# EAGLE design door_board (EAGLE 9.2.2)
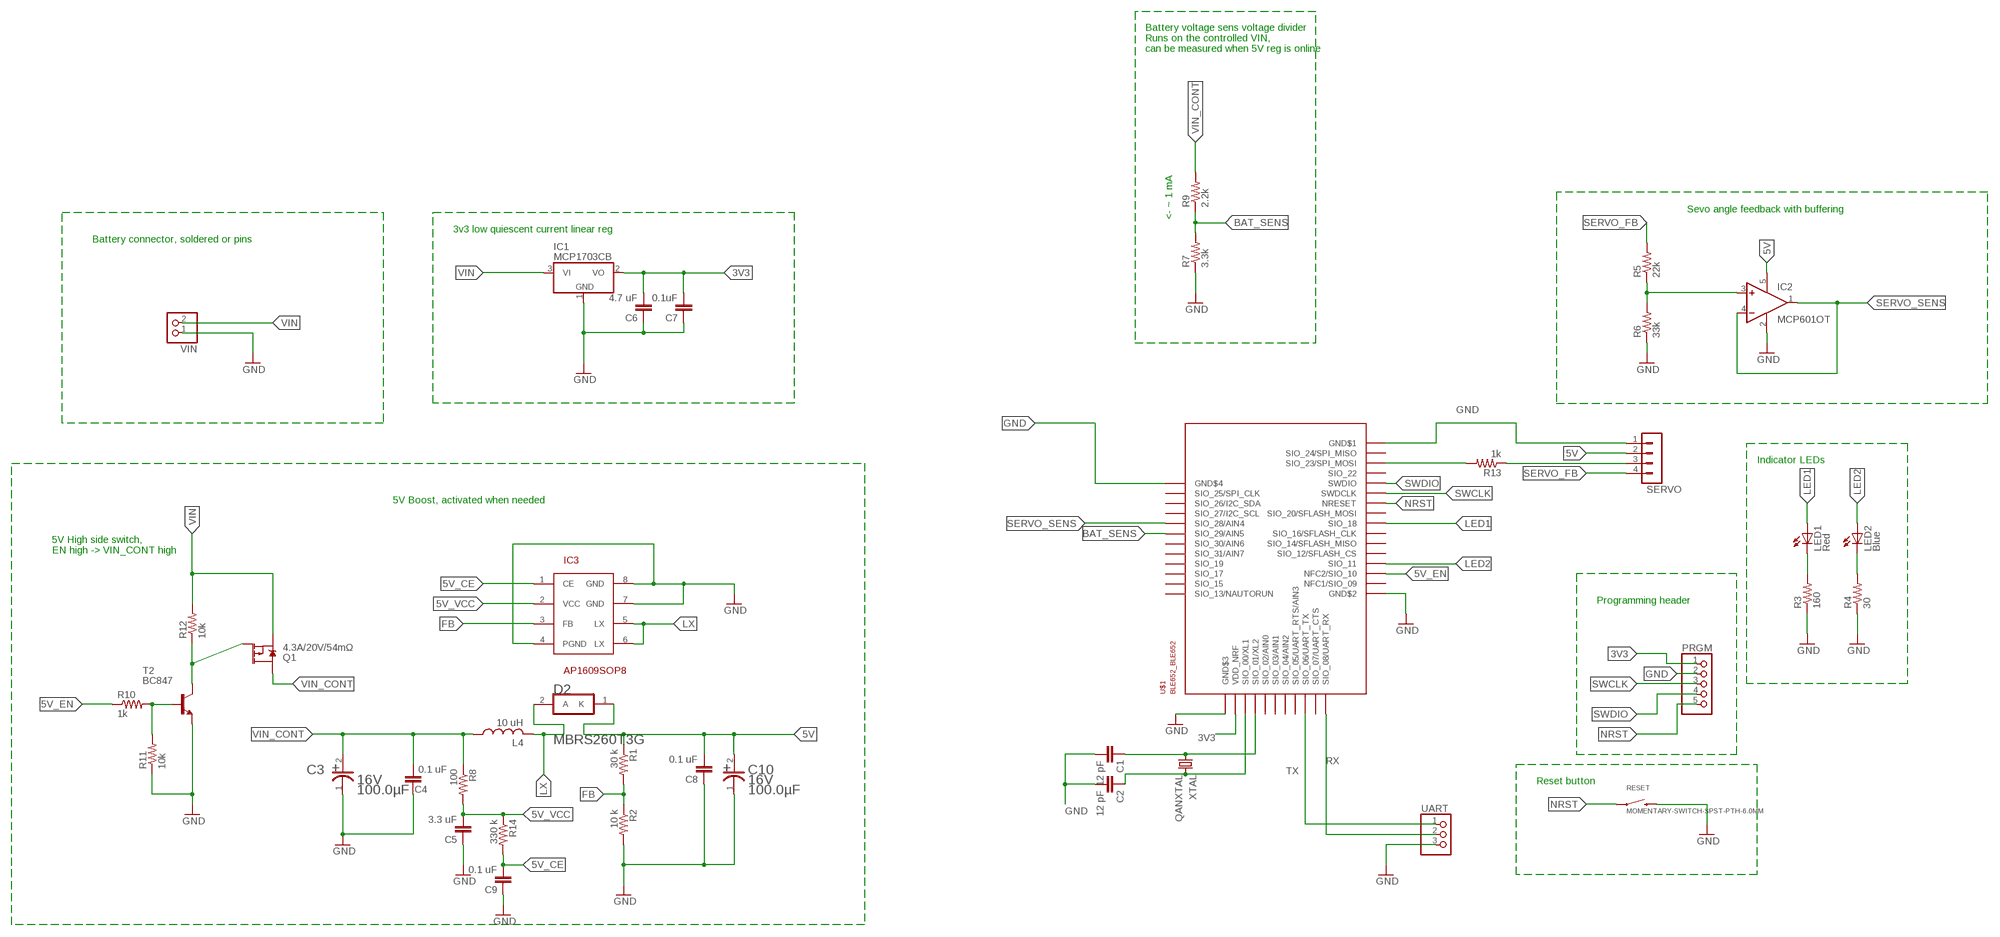
[diagram p0: schematic, sheet 1]

## Parts
C1  12 pF  C-EUC0603  [C0603]
C2  12 pF  C-EUC0603  [C0603]
C3  PANASONIC_EEE-FK1C101PPANASONIC_EEE-FK1C101P_0_0  [PANASONIC_EEE-FK1C101P_0]
C4  0.1 uF  C-EUC0805  [C0805]
C5  3.3 uF  C-EUC0805  [C0805]
C6  4.7 uF  C-EUC0805  [C0805]
C7  0.1uF  C-EUC0805  [C0805]
C8  0.1 uF  C-EUC0805  [C0805]
C9  0.1 uF  C-EUC0805  [C0805]
C10  PANASONIC_EEE-FK1C101PPANASONIC_EEE-FK1C101P_0_0  [PANASONIC_EEE-FK1C101P_0]
D2  ON_SEMICONDUCTOR_MBRS260T3GON_SEMICONDUCTOR_MBRS260T3G_0_0  [ON_SEMICONDUCTOR_MBRS260T3G_0]
IC1  MCP1703CB  [SOT23]
IC2  MCP601OT  [SOT23-5]
IC3  AP1609SOP8  [SOIC127P600X175-8]
L4  10 uH  FDSD0420  [SMT]
LED1  Red  LEDCHIP-LED0805  [CHIP-LED0805]
LED2  Blue  LEDCHIP-LED0805  [CHIP-LED0805]
PRGM  PINHD-1X5  [1X05]
Q1  4.3A/20V/54mΩ  MOSFET_PCH-IRLML2244  [SOT23-3]
R1  30 k  R-US_M0805  [M0805]
R2  10 k  R-US_M0805  [M0805]
R3  160  R-US_M0805  [M0805]
R4  30  R-US_M0805  [M0805]
R5  22k  R-US_M0805  [M0805]
R6  33k  R-US_M0805  [M0805]
R7  3.3k  R-US_M0805  [M0805]
R8  100  R-US_M0805  [M0805]
R9  2.2k  R-US_M0805  [M0805]
R10  1k  R-US_M0805  [M0805]
R11  10k  R-US_M0805  [M0805]
R12  10k  R-US_M0805  [M0805]
R13  1k  R-US_M0805  [M0805]
R14  330 k  R-US_M0805  [M0805]
RESET  MOMENTARY-SWITCH-SPST-PTH-6.0MM  [TACTILE_SWITCH_PTH_6.0MM]
SERVO  MA04-1  [MA04-1]
T2  BC847  [SOT23]
U$1  BLE652_BLE652  [BLE652_BL652]
UART  PINHD-1X3  [1X03]
VIN  PINHD-1X2  [1X02]
XTAL  QANXTAL  [QANTEKXTAL]

## Nets
3V3: C6.2 C7.2 IC1.2(VO) PRGM.1 U$1.P$26(VDD_NRF)
5V: C8.2 C10.2(ANODE) D2.1(K) IC2.5(V+) R1.1 SERVO.2
5V_CE: C9.2 IC3.1(CE) R14.2
5V_EN: R10.1 U$1.P$14(NFC2/SIO_10)
5V_VCC: C5.2 IC3.2(VCC) R8.2 R14.1
ADFSGSDFH: IC2.3(+IN) R5.1 R6.2
BAT_SENS: R7.2 R9.1 U$1.P$34(SIO_29/AIN5)
FB: IC3.3(FB) R1.2 R2.1
GND: C1.2 C2.2 C3.1(CATHODE) C4.1 C5.1 C6.1 C7.1 C8.1 C9.1 C10.1(CATHODE) IC1.1(GND) IC2.2(V-) IC3.4(PGND) IC3.7(GND) IC3.8(GND) PRGM.2 R2.2 R3.1 R4.1 R6.1 R7.1 R11.1 RESET.3 SERVO.1 T2.2(E) U$1.P$1(GND$1) U$1.P$16(GND$2) U$1.P$27(GND$3) U$1.P$39(GND$4) UART.3 VIN.1
LED1: LED1.A U$1.P$9(SIO_18)
LED2: LED2.A U$1.P$13(SIO_11)
LX: D2.2(A) IC3.5(LX) IC3.6(LX) L4.P2
N$1: C1.1 U$1.P$24(SIO_01/XL2) XTAL.1
N$2: C2.1 U$1.P$25(SIO_00/XL1) XTAL.2
N$6: R13.1 SERVO.3
N$9: LED2.C R4.2
N$10: LED1.C R3.2
N$17: R10.2 R11.2 T2.1(B)
N$18: Q1.1(G) R12.1 T2.3(C)
N$20: R13.2 U$1.P$3(SIO_23/SPI_MOSI)
NRST: PRGM.5 RESET.1 U$1.P$7(NRESET)
RX: U$1.P$17(SIO_08/UART_RX) UART.2
SERVO_FB: R5.2 SERVO.4
SERVO_SENS: IC2.1(OUT) IC2.4(-IN) U$1.P$35(SIO_28/AIN4)
SWCLK: PRGM.3 U$1.P$6(SWDCLK)
SWDIO: PRGM.4 U$1.P$5(SWDIO)
TX: U$1.P$19(SIO_06/UART_TX) UART.1
VIN: IC1.3(VI) Q1.2(S) R12.2 VIN.2
VIN_CONT: C3.2(ANODE) C4.2 L4.P1 Q1.3(D) R8.1 R9.2
Unconnected: U$1.P$2(SIO_24/SPI_MISO) U$1.P$4(SIO_22) U$1.P$8(SIO_20/SFLASH_MOSI) U$1.P$10(SIO_16/SFLASH_CLK) U$1.P$11(SIO_14/SFLASH_MISO) U$1.P$12(SIO_12/SFLASH_CS) U$1.P$15(NFC1/SIO_09) U$1.P$18(SIO_07/UART_CTS) U$1.P$20(SIO_05/UART_RTS/AIN3) U$1.P$21(SIO_04/AIN2) U$1.P$22(SIO_03/AIN1) U$1.P$23(SIO_02/AIN0) U$1.P$28(SIO_13/NAUTORUN) U$1.P$29(SIO_15) U$1.P$30(SIO_17) U$1.P$31(SIO_19) U$1.P$32(SIO_31/AIN7) U$1.P$33(SIO_30/AIN6) U$1.P$36(SIO_27/I2C_SCL) U$1.P$37(SIO_26/I2C_SDA) U$1.P$38(SIO_25/SPI_CLK)

## Notes on the sheet
- Battery voltage sens voltage divider
  Runs on the controlled VIN, 
  can be measured when 5V reg is online
- <- ~ 1 mA
- Sevo angle feedback with buffering
- 3v3 low quiescent current linear reg
- Battery connector, soldered or pins
- Indicator LEDs
- 5V Boost, activated when needed
- 5V High side switch,
  EN high -> VIN_CONT high
- Programming header
- Reset button

## Library data of the parts
C1 C2 C4-C9 = rcl:C-EU: CAPACITOR, European symbol; SPICEPREFIX: C
C3 C10 = Panasonic - EEE-FK1C101P:PANASONIC_EEE-FK1C101P: Cap Aluminum Lytic 100uF 16V 20% (6.3 X 5.8mm) SMD 240mA 2000h 105C Automotive T/R; CAPACITANCE: 100.0µF; CENTROID_NOT_SPECIFIED: No; DATASHEET: https://industrial.panasonic.com/cdbs/www-data/pdf/RDE0000/ABA0000C1181.pdf; DIGIKEY_DESCRIPTION: CAP ALUM 100UF 20% 16V SMD; DIGIKEY_PART_NUMBER: PCE3783CT-ND; LEAD_FREE: yes; MF: Panasonic; MFG_PACKAGE_IDENT: EEEFK; MOUSER_DESCRIPTION: Aluminum Electrolytic Capacitors - SMD 100uF 16V; MOUSER_PART_NUMBER: 667-EEE-FK1C101P; MPN: EEE-FK1C101P; PACKAGE: RADIAL; PREFIX: C; ROHS: yes; TEMPERATURE_RANGE_HIGH: +105°C; TEMPERATURE_RANGE_LOW: -55°C; VOLTAGE: 16V
D2 = On Semiconductor - MBRS260T3G:ON_SEMICONDUCTOR_MBRS260T3G: ONSC-D-K1A2-2_A; CIIVA_IDS: 816703; COMPONENT_LINK_1_DESCRIPTION: Manufacturer URL; COMPONENT_LINK_1_URL: http://www.onsemi.com/; COMPONENT_LINK_3_DESCRIPTION: Package Specification; COMPONENT_LINK_3_URL: http://www.onsemi.com/pub_link/Collateral/403A-03.PDF; CONFIGURATION: Single; DATASHEET: http://www.onsemi.com/pub_link/Collateral/MBRS260T3-D.PDF; DATASHEET_VERSION: Rev. 7; FOOTPRINT_VARIANT_NAME_0: Manufacturer Recommended; IFSM_MAX_A: 60; IMPORTED: yes; IMPORTED_FROM: vault; IMPORT_TS: 1521863410; MF: On Semiconductor; MOUNTING_TECHNOLOGY: Surface Mount; MPN: MBRS260T3G; PACKAGE: SMB-2-403A-03; PACKAGE_DESCRIPTION: 2-Pin Small Molded Package, J-Bend Lead, Body 4.33 x 3.625 mm; PACKAGE_VERSION: Rev. J, 07/2012; PACKING: Tape and Reel; PREFIX: D; RELEASE_DATE: 1407123037; ROHS: Yes; VAULT_GUID: 0415DD07-B68C-4AAD-A0F5-28F72E58D1C2; VAULT_REVISION: C386476E-57C5-435E-9BA6-C49E34E234E7
IC1 = linear:MCP1703: 250 mA, 16V, Low Quiescent Current LDO Regulator Source: http://ww1.microchip.com/downloads/en/DeviceDoc/22049b.pdf
IC2 = linear:MCP601: Single Op Amp 2.7V to 6.0V Single Supply CMOS Source: http://ww1.microchip.com/downloads/en/DeviceDoc/21314g.pdf
IC3 = AP1609:AP1609
L4 = FDSD0420:FDSD0420
LED1 LED2 = adafruit:LED: LED OSRAM: - CHIPLED LG R971, LG N971, LY N971, LG Q971, LY Q971, LO R971, LY R971 LH N974, LH R974 LS Q976, LO Q976, LY Q976 LO Q996 - Hyper CHIPLED LW Q18S LB Q993, LB Q99A, LB R99A - SideLED LS A670, LO A670, LY A670, LG A670, LP A670 LB A673, LV A673, LT A673, LW A673 LH A674 LY A675 LS A676, LA A676, LO A676, LY A676, LW A676 LS A679, LY A679, LG A679 - Hyper Micro SIDELED® LS Y876, LA Y876, LO Y876, LY Y876 LT Y87S - SmartLED LW L88C, LW L88S LB L89C, LB L89S, LG L890 LS L89K, LO L89K, LY L89K LS L896, LA L896, LO L896, LY L896 - TOPLED LS T670, LO T670, LY T670, LG T670, LP T670 LSG T670, LSP T670, LSY T670, LOP T670, LYG T670 LG T671, LOG T671, LSG T671 LB T673, LV T673, LT T673, LW T673 LH T674 LS T676, LA T676, LO T676, LY T676, LB T676, LH T676, LSB T676, LW T676 LB T67C, LV T67C, LT T67C, LS T67K, LO T67K, LY T67K, LW E67C LS E67B, LA E67B, LO E67B, LY E67B, LB E67C, LV E67C, LT E67C LW T67C LS T679, LY T679, LG T679 LS T770, LO T770, LY T770, LG T770, LP T770 LB T773, LV T773, LT T773, LW T773 LH T774 LS E675, LA E675, LY E675, LS T675 LS T776, LA T776, LO T776, LY T776, LB T776 LHGB T686 LT T68C, LB T68C - Hyper Mini TOPLED® LB M676 - Mini TOPLED Santana® LG M470 LS M47K, LO M47K, LY M47K Source: http://www.osram.convergy.de/
PRGM = pinhead:PINHD-1X5: PIN HEADER
Q1 = SparkFun-DiscreteSemi:MOSFET_PCH: P-channel MOSFETs Voltage controlled devices that allow control of high current outputs. SparkFun Products: SparkFun ESP32 Thing <https://www.sparkfun.com/products/13907> SparkFun ESP8266 Thing <https://www.sparkfun.com/products/13231>; PROD_ID: TRANS-11153
R1-R14 = adafruit:R-US_: RESISTOR, American symbol
RESET = SparkFun-Switches:MOMENTARY-SWITCH-SPST: Momentary Switch (Pushbutton) - SPST Normally-open (NO) SPST momentary switches (buttons, pushbuttons). Variants PTH-12MM - 12mm square, through-hole Momentary Pushbutton Switch - 12mm Square <https://www.sparkfun.com/products/9190> (COM-09190) PTH-6.0MM, PTH-6.0MM-KIT - 6.0mm square, through-hole Mini Pushbutton Switch <https://www.sparkfun.com/products/97> (COM-00097) KIT package intended for soldering kit's - only one side of pads' copper is exposed. PTH-RIGHT-ANGLE-KIT - Right-angle, through-hole Right Angle Tactile Button <https://www.sparkfun.com/products/10791> - Used on SparkFun BigTime Watch Kit <https://www.sparkfun.com/products/11734> SMD-12MM - 12mm square, surface-mount Tactile Button - SMD (12mm) <https://www.sparkfun.com/products/12993> (COM-12993) Used on SparkFun PicoBoard <https://www.sparkfun.com/products/11888> SMD-4.5MM - 4.5mm Square Trackball Switch Used on SparkFun Blackberry Trackballer Breakout <https://www.sparkfun.com/products/13169> SMD-4.6MMX2.8MM - 4.60mm x 2.80mm, surface mount Used on SparkFun SAMD21 Mini Breakout <https://www.sparkfun.com/products/13664> SMD-5.2MM, SMD-5.2-REDUNDANT - 5.2mm square, surface-mount Mini Pushbutton Switch - SMD <https://www.sparkfun.com/products/8720> (COM-08720) Used on Arduino Pro Mini <https://www.sparkfun.com/products/11114> REDUNDANT package connects both switch circuits together SMD-6.0X3.5MM - 6.0 x 3.5mm, surface mount Momentary Reset Switch SMD <https://www.sparkfun.com/products/8229> (COM-08229) SMD-6.2MM-TALL - 6.2mm square, surface mount Tactile Button - SMD (6mm) <https://www.sparkfun.com/products/12992> Used on SparkFun Digital Sandbox <https://www.sparkfun.com/products/12651> SMD-RIGHT-ANGLE - Right-angle, surface mount Used on SparkFun Block for Intel® Edison - Arduino <https://www.sparkfun.com/products/13036>; PROD_ID: SWCH-08441; SF_SKU: COM-00097
SERVO = con-lstb:MA04-1: PIN HEADER; OC_FARNELL: unknown; OC_NEWARK: unknown
T2 = transistor:BC847: NPN TRANSISTOR
U$1 = prototype1:BLE652_BLE652
UART = pinhead:PINHD-1X3: PIN HEADER
VIN = pinhead:PINHD-1X2: PIN HEADER
XTAL = BLE:QANXTAL

## Board
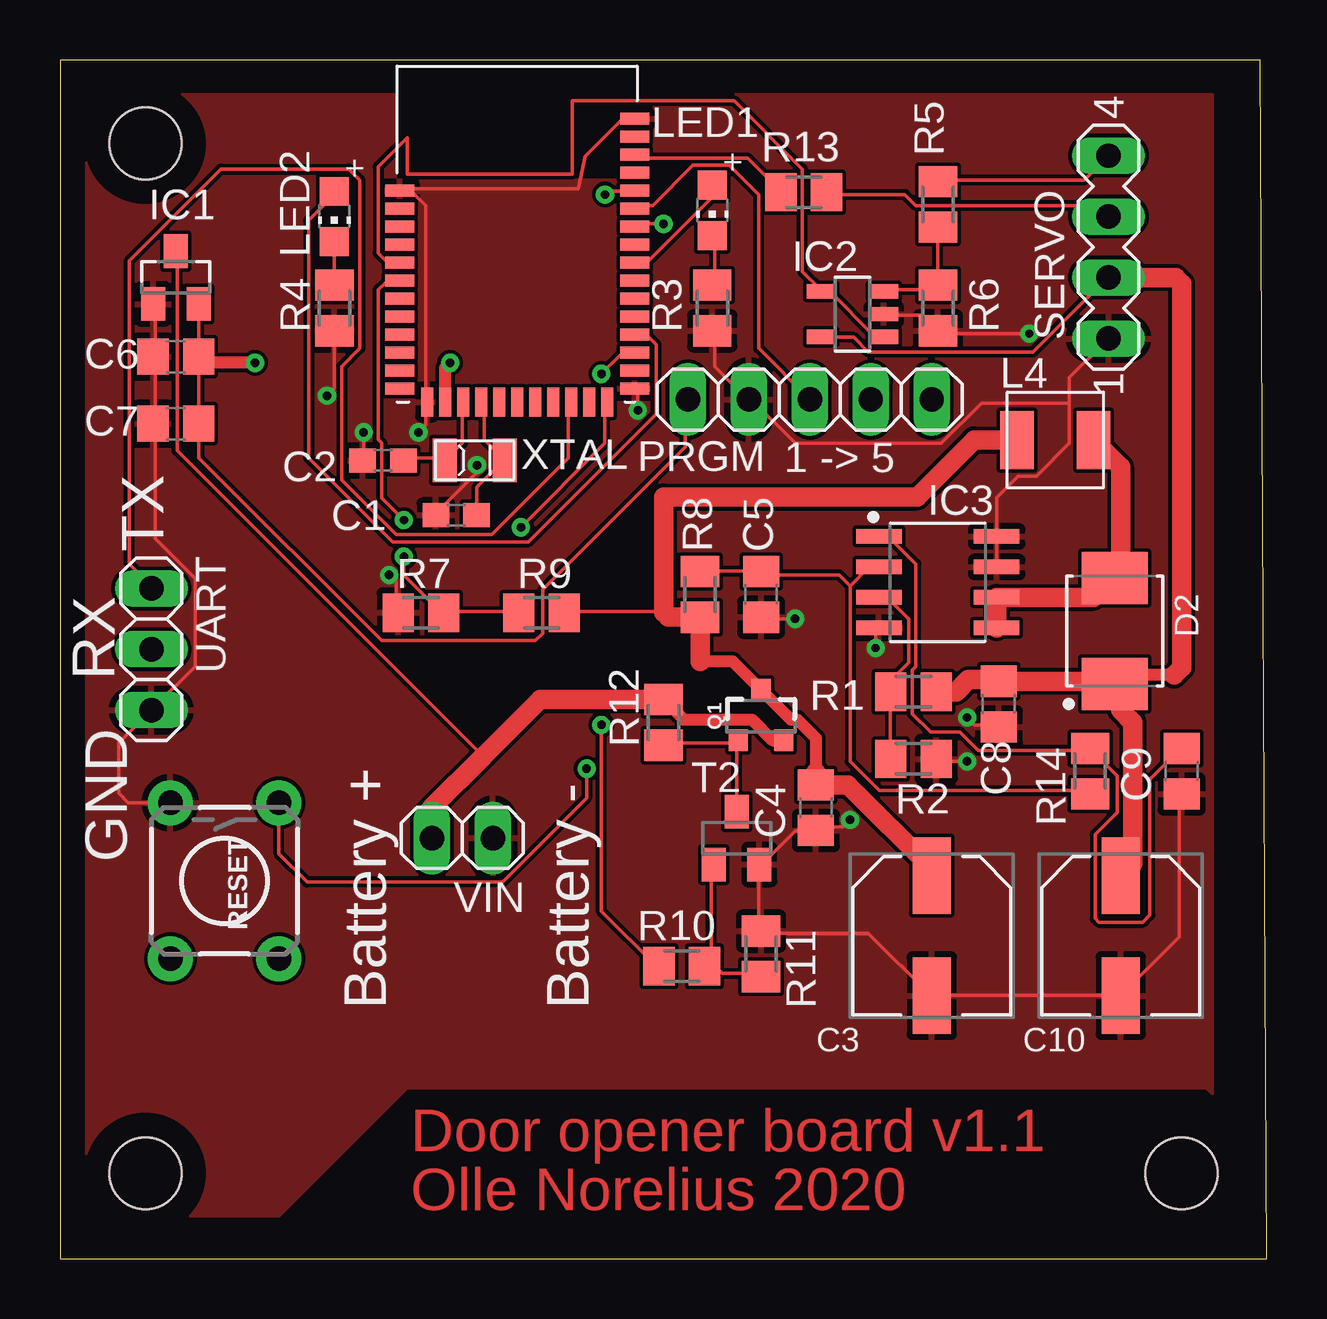
[diagram p1: board, top side]
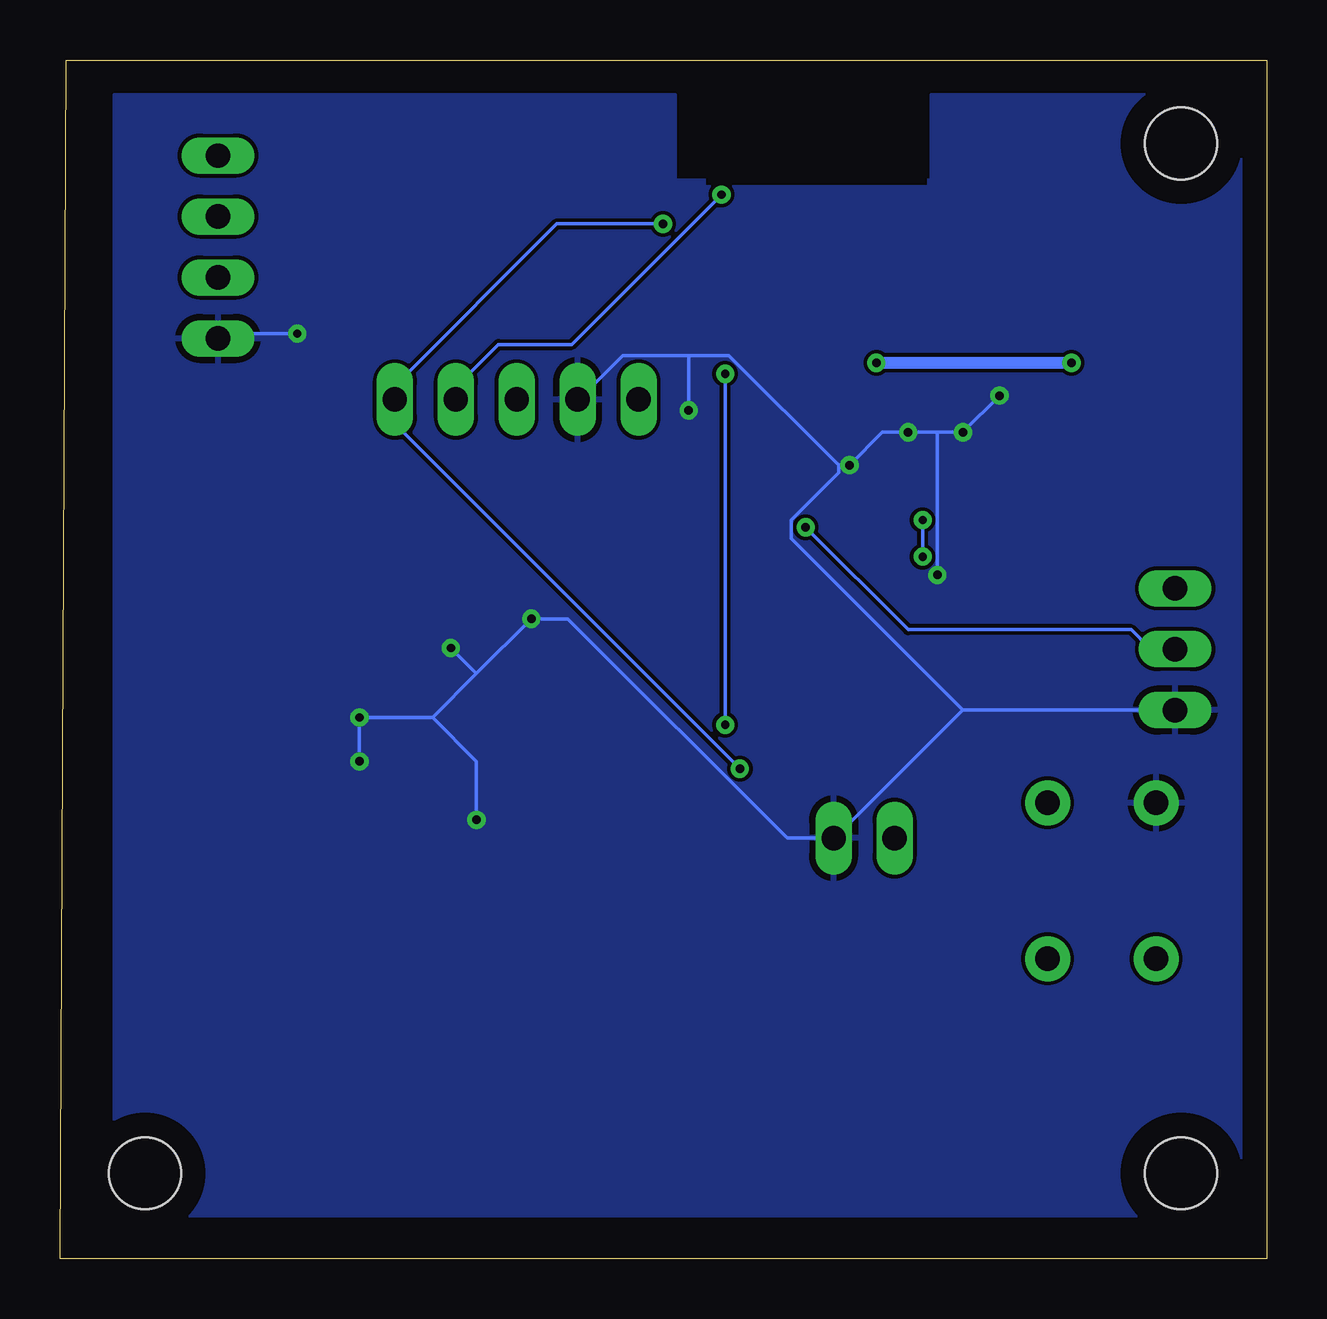
[diagram p2: board, bottom side, seen from below]

Size 50.27 x 49.96 mm. Coordinates in mm from the lower left corner, seen from the top.
Outline: 0,0 50.27,0 50.02,49.96 0,49.96 0,0
Copper layers (1*16): Top 0.035mm / dielectric 1.5mm / Bottom 0.035mm
Design rules "default": minimum track width 6mil, minimum drill 0.35mm, track to track 6mil, track to pad 6mil, pad to pad 6mil, via to via 6mil, smd to smd 6mil, copper to edge 40mil, drill to drill 6mil, minimum pad ring 10mil, minimum via ring 8mil, stop-mask expansion 4mil, vias tented up to drill 0mil, thermal gap 10mil
Holes 3 mm at 3.56,3.56 3.56,46.48 46.74,3.56
tKeepout: area 14.2,45.3 to 24.4,50; area 18.7,43.3 to 21.4,45.3

### Footprints (pad centres in the part's own frame; a part is rotated, then mirrored left to right if it is on the bottom)
C0603 = smd 1.1 x 1: 1 -0.85,0; 2 0.85,0
PANASONIC_EEE-FK1C101P_0 = smd 3.2 x 1.6: 1 -2.5,0; 2 2.5,0
C0805 = smd 1.3 x 1.5: 1 -0.95,0; 2 0.95,0
ON_SEMICONDUCTOR_MBRS260T3G_0 = smd 2.159 x 2.743: 1 -2.21,0; 2 2.21,0
SOT23 = smd 1 x 1.4: 1 -0.95,-1.1; 2 0.95,-1.1; 3 0,1.1
SOT23-5 = smd 0.6 x 1.2: 1 -0.95,-1.306; 2 0,-1.306; 3 0.95,-1.306; 4 0.95,1.306; 5 -0.95,1.306
SOIC127P600X175-8 = smd 1.896 x 0.602: 1 -2.452,1.905; 2 -2.452,0.635; 3 -2.452,-0.635; 4 -2.452,-1.905; 5 2.452,-1.905; 6 2.452,-0.635; 7 2.452,0.635; 8 2.452,1.905
SMT = smd 1.4 x 2.4: P1 -1.6,0; P2 1.6,0
CHIP-LED0805 = smd 1.2 x 1.2: A 0,-1.05; C 0,1.05
1X05 = drill 1.016 long: 1 -5.08,0; 2 -2.54,0; 3 0,0; 4 2.54,0; 5 5.08,0
SOT23-3 = smd 0.8 x 0.9: 1 -0.95,-1; 2 0.95,-1; 3 0,1.1
M0805 = smd 1.3 x 1.6: 1 -0.95,0; 2 0.95,0
TACTILE_SWITCH_PTH_6.0MM = drill 1.016 pad 1.88: 1 -3.251,2.261; 2 3.251,2.261; 3 -3.251,-2.261; 4 3.251,-2.261
MA04-1 = drill 1.016 long: 1 -3.81,0; 2 -1.27,0; 3 1.27,0; 4 3.81,0
BLE652_BL652 = smd 0.5 x 1.2: P$1 2.8,-4.9; P$2 2.05,-4.9; P$3 1.3,-4.9; P$4 0.55,-4.9; P$5 -0.2,-4.9; P$6 -0.95,-4.9; P$7 -1.7,-4.9; P$8 -2.45,-4.9; P$9 -3.2,-4.9; P$10 -3.95,-4.9; P$11 -4.7,-4.9; P$12 -5.45,-4.9; P$13 -6.2,-4.9; P$14 -6.95,-4.9; P$15 -7.7,-4.9; P$16 -8.45,-4.9; P$28 -8.45,4.9; P$29 -7.7,4.9; P$30 -6.95,4.9; P$31 -6.2,4.9; P$32 -5.45,4.9; P$33 -4.7,4.9; P$34 -3.95,4.9; P$35 -3.2,4.9; P$36 -2.45,4.9; P$37 -1.7,4.9; P$38 -0.95,4.9; P$39 -0.2,4.9 | smd 1.2 x 0.5: P$17 -9,-3.75; P$18 -9,-3; P$19 -9,-2.25; P$20 -9,-1.5; P$21 -9,-0.75; P$22 -9,0; P$23 -9,0.75; P$24 -9,1.5; P$25 -9,2.25; P$26 -9,3; P$27 -9,3.75
1X03 = drill 1.016 long: 1 -2.54,0; 2 0,0; 3 2.54,0
1X02 = drill 1.016 long: 1 -1.27,0; 2 1.27,0
QANTEKXTAL = smd 1 x 1.8: 1 -1,0; 2 1.5,0

### Placement (x,y rotation side)
C1  16.51,30.99 180 top
C2  13.46,33.27 180 top
C3  36.32,13.46 90 top
C4  31.5,18.8 90 top
C5  29.21,27.69 90 top
C6  4.83,37.59 0 top
C7  4.83,34.8 0 top
C8  39.12,23.11 90 top
C9  46.74,20.32 90 top
C10  44.2,13.46 90 top
D2  43.94,26.16 90 top
IC1  4.83,40.89 0 top
IC2  33.02,39.37 90 top
IC3  36.58,28.19 0 top
L4  41.47,34.12 0 top
LED1  27.18,43.69 180 top
LED2  11.43,43.43 180 top
PRGM  31.24,35.81 0 top
Q1  29.21,22.61 0 top
R1  35.56,23.62 180 top
R2  35.56,20.83 0 top
R3  27.18,39.62 90 top
R4  11.43,39.62 90 top
R5  36.58,43.94 90 top
R6  36.58,39.62 90 top
R7  15.04,26.92 0 top
R8  26.67,27.69 90 top
R9  20.07,26.92 0 top
R10  25.91,12.19 0 top
R11  29.21,12.7 270 top
R12  25.15,22.35 90 top
R13  30.99,44.45 180 top
R14  42.93,20.32 90 top
RESET  6.86,15.75 270 top
SERVO  43.69,42.16 90 top
T2  28.19,17.53 0 top
U$1  19.05,44.7 90 top
UART  3.81,25.4 270 top
VIN  16.76,17.53 180 top
XTAL  17.53,33.27 180 top

### Tracks (layer width: path | path; a pad name or v marks a point on that pad's centre or on a via)
3V3  (via drill 0.35)
  Top 0.152: IC1.2 5.79,39.78 5.79,37.64 C6.2 5.79,37.49 5.79,37.34 5.79,34.9 C7.2 5.79,34.75 5.79,33.38 13.41,25.76 19.81,25.76 20.12,26.06 20.12,27.89 26.06,33.83 26.06,35.81 PRGM.1
  Top 0.508: U$1.P$26 16.05,37.13 v16.26,37.34 | v8.13,37.34 5.79,37.34
  Bottom 0.508: v16.26,37.34 v8.13,37.34
5V
  Top 0.152: IC2.5 31.85,38.41 33.07,38.41 33.68,37.8 40.54,37.8 43.43,40.69 SERVO.2 | 44.2,22.86 44.2,23.7 D2.1 43.94,24.06
  Top 0.508: 46.42,24.32 44.2,24.32 43.94,24.06
  Top 0.813: 44.2,22.86 44.7,22.35 44.7,16.47 C10.2 | 43.94,24.06 C8.2 39.05,24.13 37.85,24.13 37.34,23.62 R1.1 | 46.42,24.32 46.74,24.64 46.74,40.64 46.48,40.89 SERVO.2
5V_CE
  Top 0.152: C9.2 46.63,21.18 45.41,19.96 45.41,14.33 45.11,14.02 43.28,14.02 43.13,14.17 43.13,17.68 44.04,18.59 44.04,20.12 42.98,21.18 R14.2 42.82,21.18 38.25,21.18 37.49,21.95 36.27,21.95 35.51,22.71 35.51,24.54 35.66,24.69 35.66,28.96 34.59,30.02 34.14,30.02 IC3.1
5V_EN  (via drill 0.35)
  Top 0.152: v22.55,36.88 23.32,37.64 23.93,37.64 U$1.P$14 | v22.55,22.25 22.55,14.48 24.84,12.19 R10.1
  Bottom 0.152: v22.55,22.25 v22.55,36.88
5V_VCC
  Top 0.152: R8.2 29.11,28.65 C5.2 29.26,28.5 32.46,28.5 32.92,28.04 | 32.92,28.04 32.92,20.73 34.14,19.51 42.82,19.51 R14.1 | 32.92,28.04 33.68,28.8 33.98,28.8 IC3.2
ADFSGSDFH
  Top 0.152: IC2.3 34.44,40.39 36.42,40.39 36.58,40.54 R6.2 R5.1
BAT_SENS  (via drill 0.35)
  Top 0.152: v14.33,30.79 13.41,31.7 13.41,33.98 13.26,34.14 13.26,40.39 13.56,40.69 14.02,40.69 U$1.P$34 | v14.33,29.26 14.33,28.5 15.85,26.98 R7.2 16,26.98 19.05,26.98 R9.1
  Bottom 0.152: v14.33,29.26 v14.33,30.79
FB
  Top 0.152: R2.1 34.59,20.88 34.59,23.62 R1.2 34.75,23.62 34.75,24.23 35.36,24.84 35.36,26.67 34.59,27.43 34.14,27.43 IC3.3
GND  (via drill 0.35)
  Top 0.152: 14.53,44.6 14.28,44.6 14.33,44.55 14.28,44.5 U$1.P$39 | 14.53,44.6 21.6,44.6 21.89,45.95 23.44,47.5 U$1.P$1 | 15.24,35.81 15.3,35.81 | IC2.2 34.44,39.32 35.97,39.32 36.58,38.71 R6.1 36.58,38.56 v40.39,38.56 | 42.06,35.66 42.06,36.73 SERVO.1 | 42.06,35.66 42.06,33.98 40.69,32.61 39.93,32.61 39.03,31.71 IC3.8 IC3.7 | 15.24,35.81 15.24,43.89 14.53,44.6 | 15.24,35.81 U$1.P$27 15.24,35.66 15.24,34.75 v14.94,34.44 | v17.37,33.07 17.37,32.77 15.7,31.09 C1.2 | v12.65,34.44 12.65,33.38 C2.2 | v24.08,35.36 24.08,36.12 U$1.P$16 | v13.72,28.5 14.02,28.19 14.02,26.98 R7.1 | R4.1 11.43,36.27 v11.12,35.97 | R3.1 27.28,38.56 27.28,37.19 28.65,35.81 PRGM.2 28.8,35.81 30.63,33.98 36.73,33.98 38.41,35.66 42.06,35.66 | 44.2,10.97 46.63,13.41 46.63,19.36 C9.1 | 44.2,10.97 36.42,10.97 C3.1 36.27,10.97 33.68,13.56 29.26,13.56 R11.1 29.11,13.72 29.11,16.31 T2.2 29.26,16.46 30.63,17.83 31.39,17.83 C4.1 31.55,17.98 32.61,17.98 v32.92,18.29 | 44.2,10.97 C10.1 | IC1.1 3.96,39.78 3.96,37.64 C6.1 3.96,37.49 3.96,34.9 C7.1 3.96,34.75 3.96,30.02 5.64,28.35 5.64,24.69 UART.3 2.44,21.49 2.44,19.41 2.85,19 RESET.3 | v30.63,26.67 29.26,26.67 C5.1 | v37.8,22.55 38.1,22.25 39.01,22.25 C8.1 | v37.8,20.73 36.58,20.73 R2.2 | v33.98,25.45 33.98,26.21 IC3.4
  Bottom 0.152: v40.39,38.56 43.43,38.56 43.59,38.41 SERVO.1 | 17.83,33.07 v17.37,33.07 16,34.44 v14.94,34.44 13.72,34.44 | 17.83,33.07 22.4,37.64 24.08,37.64 | 24.08,37.64 26.82,37.64 28.65,35.81 PRGM.2 | 13.72,34.44 v12.65,34.44 v11.12,35.97 | 24.08,37.64 v24.08,35.36 | 13.72,34.44 v13.72,28.5 | 34.75,22.55 v37.8,22.55 v37.8,20.73 | 32.92,24.38 v30.63,26.67 29.11,26.67 19.96,17.53 VIN.1 17.98,17.53 12.65,22.86 | 32.92,24.38 34.75,22.55 | 32.92,24.38 v33.98,25.45 | 12.65,22.86 UART.3 | v32.92,18.29 32.92,20.73 34.75,22.55 | 17.83,33.07 17.83,32.77 19.81,30.79 19.81,30.02 12.65,22.86
  pour Top: 1.02,48.51 13.97,48.51 13.97,44.96 24.64,44.96 24.64,48.51 48.01,48.51 48.01,6.86 47.75,7.11 14.48,7.11 9.14,1.78 1.02,1.78
  pour Bottom: 1.02,48.51 13.97,48.51 13.97,44.96 24.64,44.96 24.64,48.51 48.01,48.51 48.01,1.78 1.02,1.78
LED1
  Top 0.152: U$1.P$9 24.08,41.6 24.54,41.6 27.13,44.2 27.13,44.65 LED1.A
LED2
  Top 0.152: U$1.P$13 24.08,38.41 24.54,38.41 24.84,38.1 24.84,35.2 19.51,29.87 13.87,29.87 10.36,33.38 10.36,43.28 11.43,44.35 LED2.A
LX
  Top 0.152: D2.2 43.94,28.45 43.94,28.57 43.69,28.83
  Top 0.813: L4.P2 44.2,32.99 44.2,29.34 43.69,28.83 | IC3.5 IC3.6 43.05,27.56 43.94,28.45
N$1
  Top 0.152: C1.1 17.37,31.09 17.37,32.16 18.44,33.22 XTAL.1 18.44,33.38 17.68,34.14 17.68,35.66 U$1.P$24
N$2
  Top 0.152: C2.1 14.33,33.38 16,33.38 XTAL.2 16.15,33.38 16.76,33.98 16.76,35.66 U$1.P$25
N$6
  Top 0.152: R13.1 32,44.35 35.2,44.35 35.66,43.89 43.13,43.89 43.59,43.43 SERVO.3
N$9
  Top 0.152: R4.2 LED2.C
N$10
  Top 0.152: LED1.C 27.28,42.52 27.28,40.69 R3.2
N$17
  Top 0.152: 27.13,12.34 27.13,16.31 T2.1 | 27.13,12.34 26.98,12.19 R10.2 27.13,12.34 | 27.13,12.34 27.58,11.89 29.11,11.89 R11.2
N$18
  Top 0.152: T2.3 28.19,21.49 | 28.19,21.49 25.15,21.49 R12.1 | 28.19,21.49 Q1.1
N$20
  Top 0.152: U$1.P$3 24.08,45.87 28.65,45.87 30.02,44.5 R13.2
NRST  (via drill 0.35)
  Top 0.152: v25.15,43.13 24.08,43.13 U$1.P$7 | v21.95,20.42 21.95,19.2 18.44,15.7 10.3,15.7 9.12,16.88 RESET.1
  Bottom 0.152: v25.15,43.13 29.57,43.13 36.27,36.42 36.27,35.81 | v21.95,20.42 36.27,34.75 36.27,35.81 | 36.27,35.81 PRGM.5
RX  (via drill 0.35)
  Top 0.152: v19.2,30.48 22.71,33.98 22.71,35.66 U$1.P$17
  Bottom 0.152: v19.2,30.48 14.94,26.21 5.64,26.21 4.88,25.45 3.81,25.45 UART.2
SERVO_FB
  Top 0.152: SERVO.4 42.67,44.96 36.58,44.96 R5.2
SERVO_SENS
  Top 0.152: IC2.1 34.29,38.56 33.83,38.56 32.16,40.23 31.85,40.23 IC2.4 31.7,40.39 30.94,41.15 30.94,45.41 28.09,48.26 21.34,48.26 21.34,45.21 14.48,45.21 14.48,46.73 13.26,45.51 13.26,41.91 13.56,41.6 14.02,41.6 U$1.P$35
SWCLK
  Top 0.152: PRGM.3 29.11,37.95 29.11,44.35 27.89,45.57 26.36,45.57 24.69,43.89 24.08,43.89 U$1.P$6
SWDIO  (via drill 0.35)
  Top 0.152: v22.71,44.35 22.86,44.5 23.93,44.5 U$1.P$5
  Bottom 0.152: v22.71,44.35 28.96,38.1 32,38.1 33.68,36.42 33.68,35.81 PRGM.4
TX
  Top 0.152: U$1.P$19 21.18,35.66 21.18,33.38 17.98,30.18 14.02,30.18 11.73,32.46 11.73,37.19 12.5,37.95 12.5,44.96 12.04,45.41 6.71,45.41 2.9,41.6 2.9,28.96 3.81,28.04 UART.1
VIN
  Top 0.152: 17.63,20.93 4.88,33.68 4.88,41.91 IC1.3
  Top 0.508: Q1.2 29.68,21.61 28.83,22.46 25.99,22.46 R12.2
  Top 0.813: VIN.2 15.49,18.8 17.63,20.93 20,23.3 R12.2
VIN_CONT
  Top 0.152: 25.15,26.98 21.03,26.98 R9.2
  Top 0.508: C4.2 31.5,21.7 30.73,22.46 30.45,22.46 Q1.3 28.02,24.89 26.67,24.89
  Top 0.813: 31.5,20.27 C4.2 32.83,19.75 36.32,16.26 C3.2 | 26.67,24.89 R8.1 25.33,26.74 25.15,26.92 25.15,26.98 25.15,31.75 35.72,31.75 38.09,34.12 L4.P1

### Text on the board
Top: Door opener board v1.1 / Olle Norelius 2020
tNames: 1 -> 5 | TX | RX | GND | Battery + | Battery -